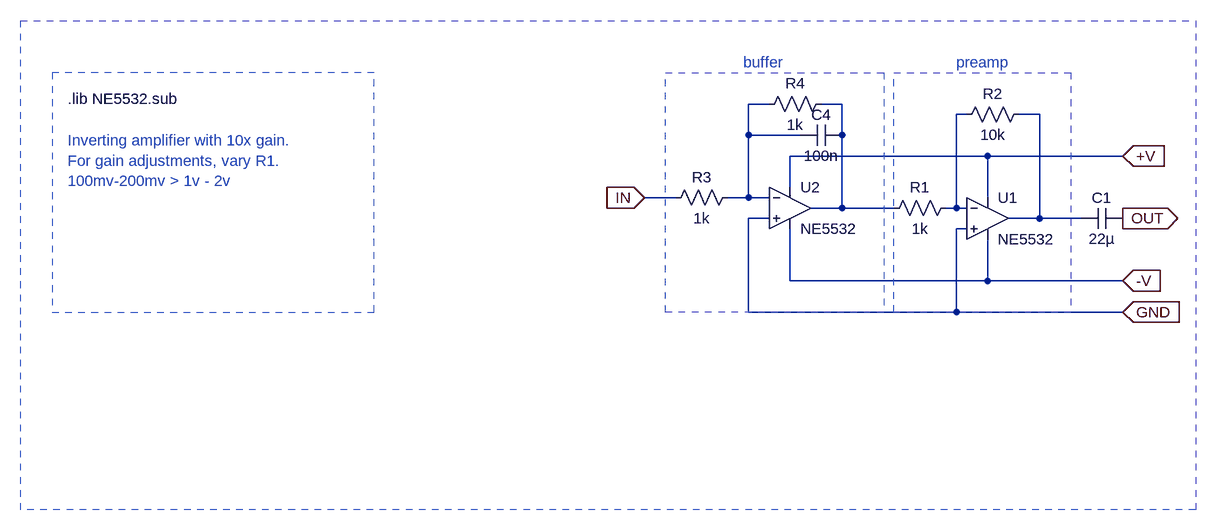
[diagram p0: schematic IPS.asc]
IPS.asc, the LTspice schematic file:
Version 4
SHEET 1 1812 680
WIRE 272 16 240 16
WIRE 384 16 352 16
WIRE 576 32 560 32
WIRE 688 32 656 32
WIRE 240 64 240 16
WIRE 320 64 240 64
WIRE 384 64 384 16
WIRE 608 96 304 96
WIRE 816 96 608 96
WIRE 304 144 304 96
WIRE 128 160 80 160
WIRE 240 160 240 64
WIRE 240 160 208 160
WIRE 272 160 240 160
WIRE 608 160 608 96
WIRE 384 176 384 64
WIRE 384 176 336 176
WIRE 464 176 384 176
WIRE 560 176 560 32
WIRE 560 176 544 176
WIRE 576 176 560 176
WIRE 272 192 240 192
WIRE 688 192 688 32
WIRE 688 192 640 192
WIRE 752 192 688 192
WIRE 576 208 560 208
WIRE 304 288 304 208
WIRE 608 288 608 224
WIRE 608 288 304 288
WIRE 816 288 608 288
WIRE 240 336 240 192
WIRE 560 336 560 208
WIRE 560 336 240 336
WIRE 816 336 560 336
FLAG 816 96 +V
IOPIN 816 96 In
FLAG 816 288 -V
IOPIN 816 288 In
FLAG 816 336 GND
IOPIN 816 336 In
FLAG 80 160 IN
IOPIN 80 160 In
FLAG 816 192 OUT
IOPIN 816 192 Out
SYMBOL OpAmps\\opamp2 608 128 R0
SYMATTR InstName U1
SYMATTR Value NE5532
SYMBOL res 560 160 R90
WINDOW 0 0 56 VBottom 2
WINDOW 3 32 56 VTop 2
SYMATTR InstName R1
SYMATTR Value 1k
SYMBOL res 672 16 R90
WINDOW 0 0 56 VBottom 2
WINDOW 3 32 56 VTop 2
SYMATTR InstName R2
SYMATTR Value 10k
SYMBOL cap 816 176 R90
WINDOW 0 0 32 VBottom 2
WINDOW 3 32 32 VTop 2
SYMATTR InstName C1
SYMATTR Value 22µ
SYMBOL OpAmps\\opamp2 304 112 R0
SYMATTR InstName U2
SYMATTR Value NE5532
SYMBOL res 224 144 R90
WINDOW 0 0 56 VBottom 2
WINDOW 3 32 56 VTop 2
SYMATTR InstName R3
SYMATTR Value 1k
SYMBOL res 368 0 R90
WINDOW 0 0 56 VBottom 2
WINDOW 3 32 56 VTop 2
SYMATTR InstName R4
SYMATTR Value 1k
SYMBOL cap 384 48 R90
WINDOW 0 0 32 VBottom 2
WINDOW 3 32 32 VTop 2
SYMATTR InstName C4
SYMATTR Value 100n
TEXT -808 8 Left 2 !.lib NE5532.sub
TEXT -808 72 Left 2 ;Inverting amplifier with 10x gain.\nFor gain adjustments, vary R1.\n100mv-200mv > 1v - 2v
TEXT 232 -48 Left 2 ;buffer
TEXT 560 -48 Left 2 ;preamp
RECTANGLE Normal 448 336 112 -32 2
RECTANGLE Normal 736 336 464 -32 2
RECTANGLE Normal 928 640 -880 -112 2
RECTANGLE Normal -832 336 -336 -32 2

The netlist it stands for:
* IPS.asc
XU1 GND N003 +V -V N004 NE5532  ; pins In+ In- V+ V- OUT
R1 N003 N002 1k
R2 N004 N003 10k
C1 OUT N004 22µ
XU2 GND N001 +V -V N002 NE5532  ; pins In+ In- V+ V- OUT
R3 N001 IN 1k
R4 N002 N001 1k
C4 N002 N001 100n
.lib NE5532.sub
* Inverting amplifier with 10x gain.
* For gain adjustments, vary R1.
* 100mv-200mv > 1v - 2v
* buffer
* preamp
.backanno
.end